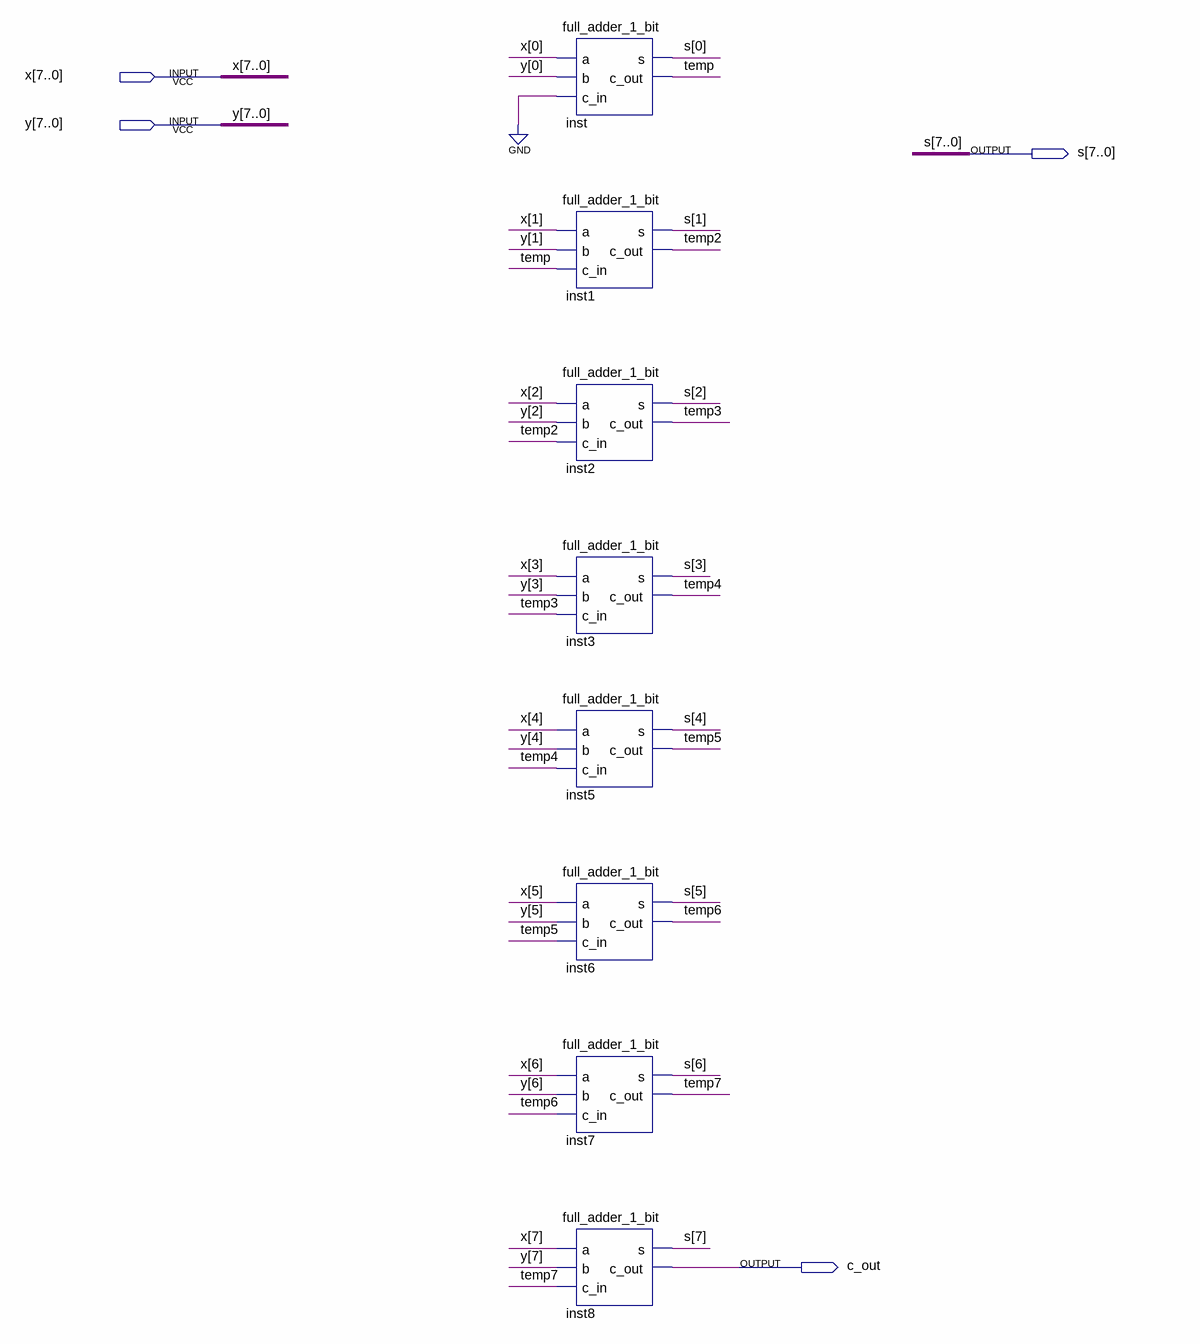
[diagram p0: schematic sheet]
// Quartus schematic full_adder_8_bit.bdf as structural Verilog: 8 symbols, 4 pins
module full_adder_8_bit (
  input  [7:0] x,
  input  [7:0] y,
  output [7:0] s,
  output c_out
);

  wire temp, temp2, temp3, temp4, temp5, temp6, temp7;

  full_adder_1_bit inst (.a(x[0]), .b(y[0]), .c_in(1'b0), .s(s[0]), .c_out(temp));
  full_adder_1_bit inst1 (.a(x[1]), .b(y[1]), .c_in(temp), .s(s[1]), .c_out(temp2));
  full_adder_1_bit inst2 (.a(x[2]), .b(y[2]), .c_in(temp2), .s(s[2]), .c_out(temp3));
  full_adder_1_bit inst3 (.a(x[3]), .b(y[3]), .c_in(temp3), .s(s[3]), .c_out(temp4));
  full_adder_1_bit inst5 (.a(x[4]), .b(y[4]), .c_in(temp4), .s(s[4]), .c_out(temp5));
  full_adder_1_bit inst6 (.a(x[5]), .b(y[5]), .c_in(temp5), .s(s[5]), .c_out(temp6));
  full_adder_1_bit inst7 (.a(x[6]), .b(y[6]), .c_in(temp6), .s(s[6]), .c_out(temp7));
  full_adder_1_bit inst8 (.a(x[7]), .b(y[7]), .c_in(temp7), .s(s[7]), .c_out(c_out));
endmodule
